# EAGLE design POWER SUPPLY_CURVE TRACER.V14 (EAGLE 7.3.0)
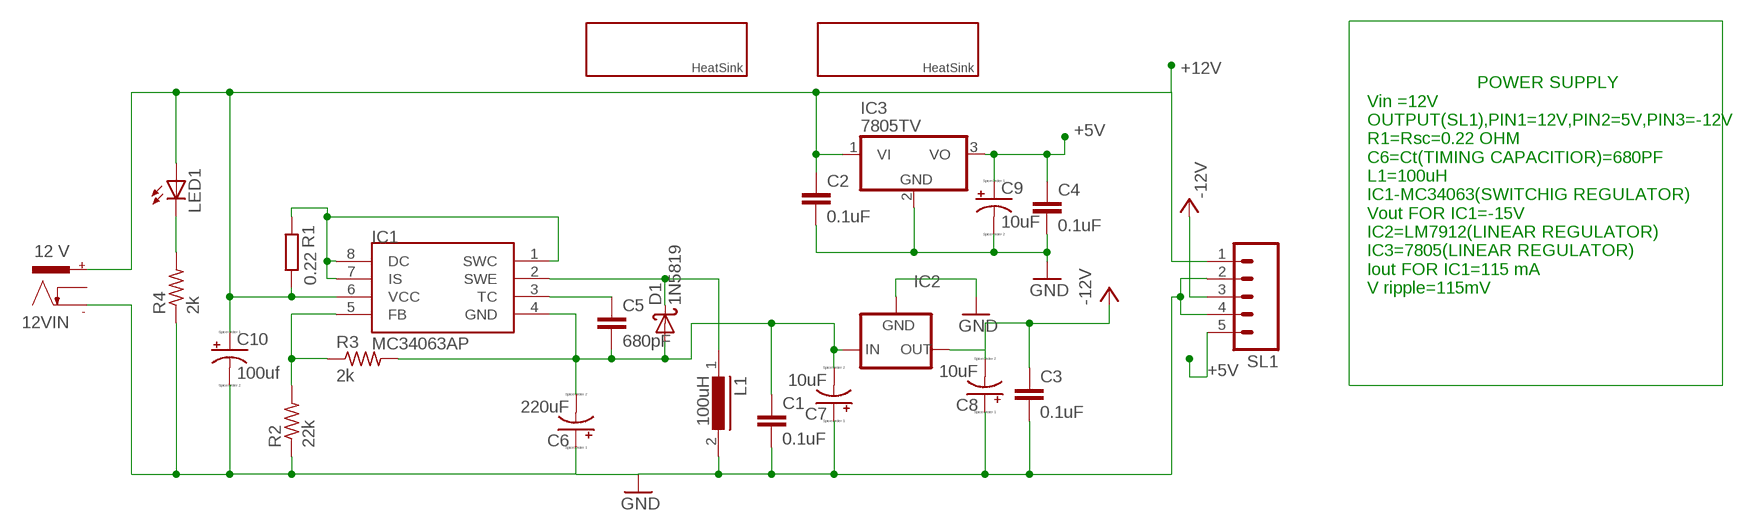
[diagram p0: schematic, sheet 1]

## Parts
12VIN  12 V  POWER_CON  [NEB21R]
C1  0.1uF  C-EU025-025X050  [C025-025X050]
C2  0.1uF  C-EU025-025X050  [C025-025X050]
C3  0.1uF  C-EU025-025X050  [C025-025X050]
C4  0.1uF  C-EU025-025X050  [C025-025X050]
C5  680pF  C-EU025-025X050  [C025-025X050]
C6  220uF  CPOL-USE2.5-7  [E2,5-7]
C7  10uF  CPOL-USE2.5-6  [E2,5-6]
C8  10uF  CPOL-USE2.5-6  [E2,5-6]
C9  10uF  CPOL-USE2.5-6  [E2,5-6]
C10  100uf  CPOL-USE2.5-7  [E2,5-7]
D1  1N5819  [DO41-10]
IC1  MC34063AP  [DIL08]
IC2  79XXS  [79XXS]
IC3  7805TV  [TO220V]
L1  100uH  82114R  [82114R]
LED1  LED3MM  [LED3MM]
R1  0.22  R-EU_0617/17  [0617/17]
R2  22k  RESISTOR0207/7  [0207/7]
R3  2k  R-US_0204/7  [0204/7]
R4  2k  RESISTOR0207/7  [0207/7]
SL1  M05  [05P]
U$1  HEATSINKMEDIUM  [HEATSINK-MED]
U$2  HEATSINKSMALL  [HEATSINK-SML]

## Nets
+5V: C4.1 C9.+ IC3.3(VO) SL1.5
+12V: 12VIN.+ C2.1 C10.+ IC1.6(VCC) IC3.1(VI) LED1.A R1.2 SL1.1
GND: 12VIN.- C1.2 C2.2 C3.2 C4.2 C6.+ C7.+ C8.+ C9.- C10.- IC2.GND IC3.2(GND) L1.2 R2.1 R4.1 SL1.2 SL1.4
N$3: IC1.5(FB) R2.2 R3.1
N$4: C1.1 C5.2 C6.- C7.- D1.A IC1.4(GND) IC2.IN R3.2
N$5: C5.1 IC1.3(TC)
N$6: D1.C IC1.2(SWE) L1.1
N$7: LED1.K(C) R4.2
N$9: IC1.1(SWC) IC1.7(IS) IC1.8(DC) R1.1
VCC: C3.1 C8.- IC2.OUT SL1.3 ; supply symbol labelled -12V
Unconnected: 12VIN.C

## Notes on the sheet
- POWER SUPPLY
  Vin =12V
  OUTPUT(SL1),PIN1=12V,PIN2=5V,PIN3=-12V
  R1=Rsc=0.22 OHM
  C6=Ct(TIMING CAPACITIOR)=680PF
  L1=100uH
  IC1-MC34063(SWITCHIG REGULATOR)
  Vout FOR IC1=-15V 
  IC2=LM7912(LINEAR REGULATOR)
  IC3=7805(LINEAR REGULATOR)
  Iout FOR IC1=115 mA
  V ripple=115mV

## Library data of the parts
12VIN = CEDT_JANUARY_2015_v5:POWER_CON: DC Power Connector
C1-C5 = rcl:C-EU: CAPACITOR, European symbol
C6-C10 = resistor:CPOL-US: POLARIZED CAPACITOR, American symbol
D1 = CEDT_JANUARY_2015_v5:1N5819: DIODE general purpose rectifier, 1 A
IC1 = mc34063:MC34063
IC2 = v-reg:79XXS: VOLTAGE REGULATOR
IC3 = linear:78*: Positive VOLTAGE REGULATOR Source: http://cache.national.com/ds/LM/LM78L05.pdf http://www.fairchildsemi.com/ds/LM/LM7805.pdf
L1 = inductors:82114R: INDUCTOR
LED1 = 01_adafruit:LED: LED OSRAM: - CHIPLED LG R971, LG N971, LY N971, LG Q971, LY Q971, LO R971, LY R971 LH N974, LH R974 LS Q976, LO Q976, LY Q976 LO Q996 - Hyper CHIPLED LW Q18S LB Q993, LB Q99A, LB R99A - SideLED LS A670, LO A670, LY A670, LG A670, LP A670 LB A673, LV A673, LT A673, LW A673 LH A674 LY A675 LS A676, LA A676, LO A676, LY A676, LW A676 LS A679, LY A679, LG A679 - Hyper Micro SIDELED® LS Y876, LA Y876, LO Y876, LY Y876 LT Y87S - SmartLED LW L88C, LW L88S LB L89C, LB L89S, LG L890 LS L89K, LO L89K, LY L89K LS L896, LA L896, LO L896, LY L896 - TOPLED LS T670, LO T670, LY T670, LG T670, LP T670 LSG T670, LSP T670, LSY T670, LOP T670, LYG T670 LG T671, LOG T671, LSG T671 LB T673, LV T673, LT T673, LW T673 LH T674 LS T676, LA T676, LO T676, LY T676, LB T676, LH T676, LSB T676, LW T676 LB T67C, LV T67C, LT T67C, LS T67K, LO T67K, LY T67K, LW E67C LS E67B, LA E67B, LO E67B, LY E67B, LB E67C, LV E67C, LT E67C LW T67C LS T679, LY T679, LG T679 LS T770, LO T770, LY T770, LG T770, LP T770 LB T773, LV T773, LT T773, LW T773 LH T774 LS E675, LA E675, LY E675, LS T675 LS T776, LA T776, LO T776, LY T776, LB T776 LHGB T686 LT T68C, LB T68C - Hyper Mini TOPLED® LB M676 - Mini TOPLED Santana® LG M470 LS M47K, LO M47K, LY M47K Source: http://www.osram.convergy.de/
R1 = rcl:R-EU_: RESISTOR, European symbol
R2 R4 = CEDT_JANUARY_2015_v5:RESISTOR
R3 = resistor:R-US_: RESISTOR, American symbol
SL1 = con-amp-quick:M05: AMP QUICK CONNECTOR; OC_FARNELL: unknown; OC_NEWARK: unknown
U$1 U$2 = CEDT_JANUARY_2015_v5:HEATSINK

## Board
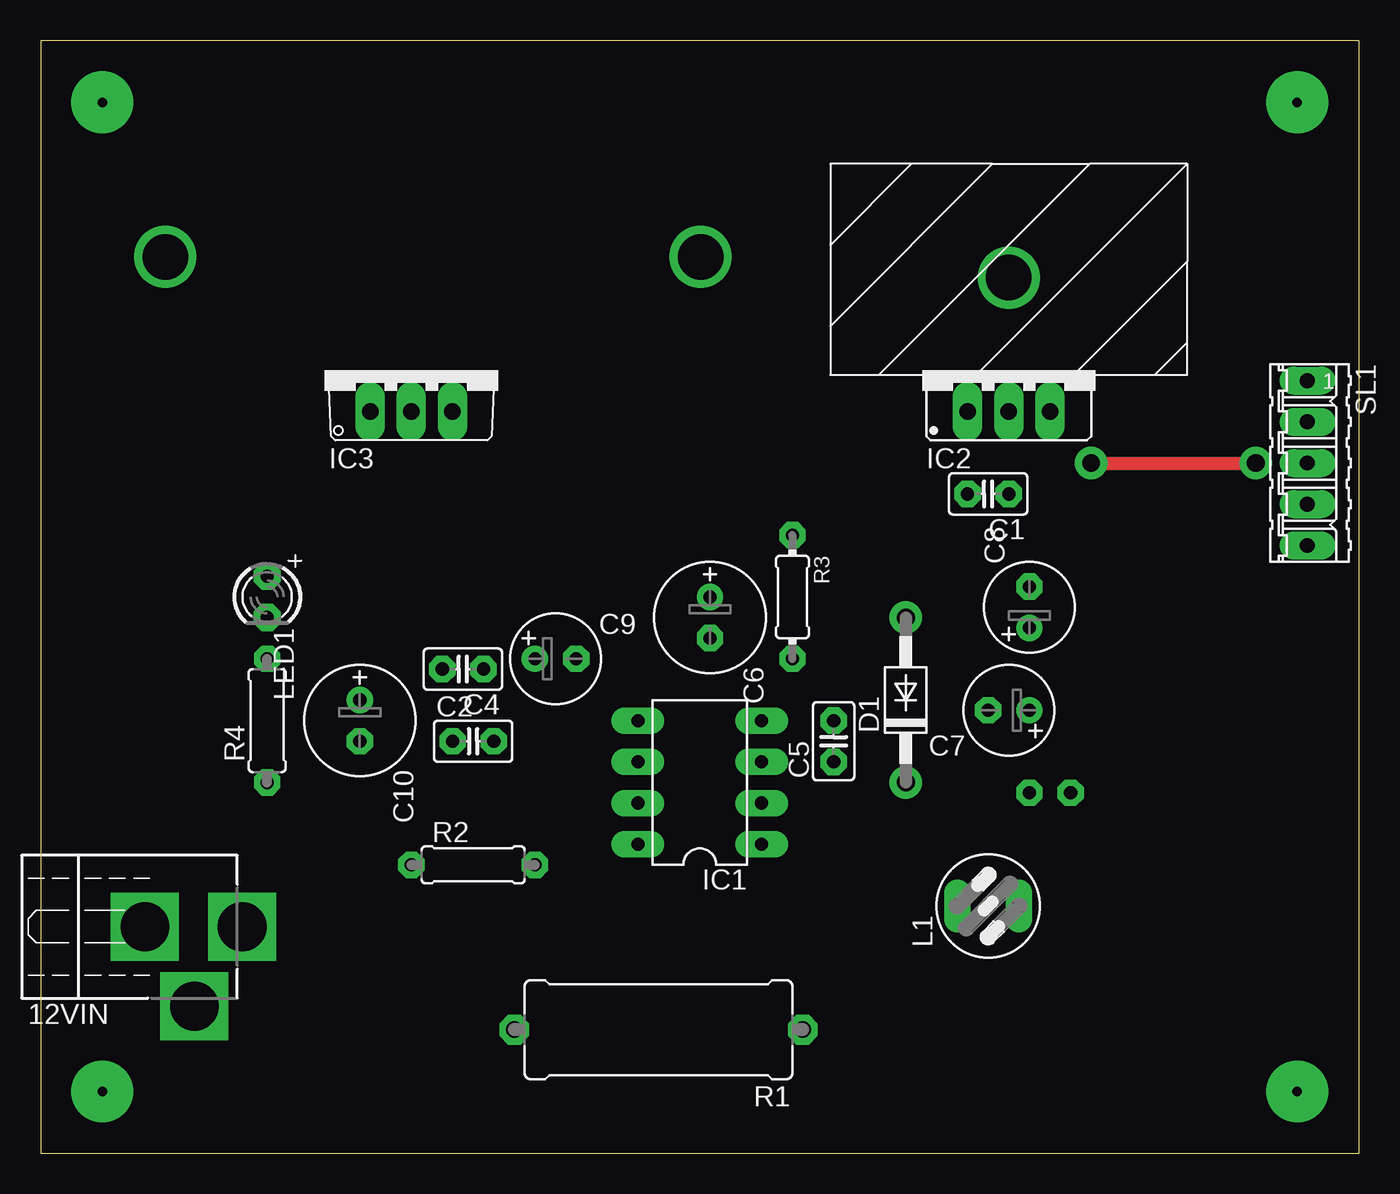
[diagram p1: board, top side]
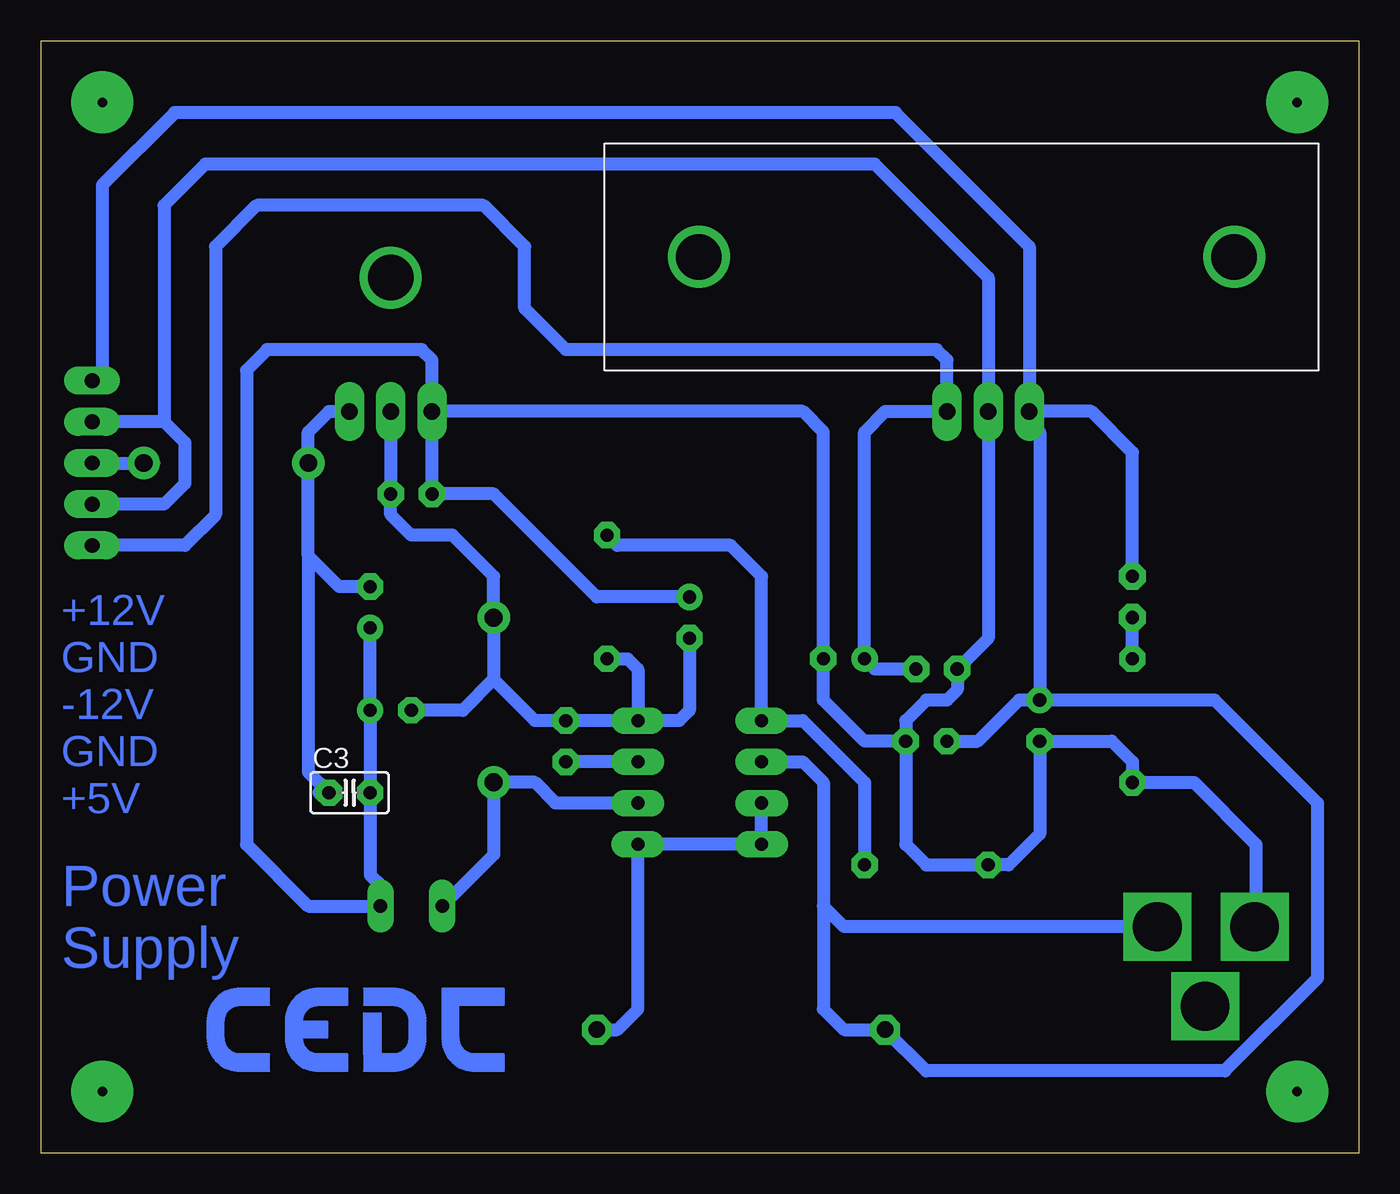
[diagram p2: board, bottom side, seen from below]

Size 81.28 x 68.58 mm. Coordinates in mm from the lower left corner, seen from the top.
Outline: 0,68.57 0,0 81.28,0 81.28,68.58 0,68.58
Copper layers (1*16): Top 0.035mm / dielectric 1.5mm / Bottom 0.035mm
Design rules "default *": minimum track width 10mil, minimum drill 24mil, track to track 12mil, track to pad 12mil, pad to pad 12mil, via to via 12mil, smd to smd 12mil, copper to edge 40mil, drill to drill 8mil, minimum pad ring 16mil, minimum via ring 16mil, stop-mask expansion 4mil, vias tented up to drill 0mil, thermal gap 10mil

### Footprints (pad centres in the part's own frame; a part is rotated, then mirrored left to right if it is on the bottom)
NEB21R = drill 3 pad 4.2 square: + 0,3.54; - 0,-2.46; C 4.9,0.59
C025-025X050 = drill 0.813 octagon: 1 -1.27,0; 2 1.27,0
E2,5-7 = drill 0.813 pad 1.6: + -1.27,0 | drill 0.813 pad 1.6 octagon: - 1.27,0
E2,5-6 = drill 0.813 pad 1.6: + -1.27,0 | drill 0.813 pad 1.6 octagon: - 1.27,0
DO41-10 = drill 1.118: A 5.08,0; C -5.08,0
DIL08 = drill 0.813 long: 1 -3.81,-3.81; 2 -1.27,-3.81; 3 1.27,-3.81; 4 3.81,-3.81; 5 3.81,3.81; 6 1.27,3.81; 7 -1.27,3.81; 8 -3.81,3.81
79XXS = drill 1.016 long: GND -2.54,-2.54; IN 0,-2.54; OUT 2.54,-2.54
TO220V = drill 1.016 long: 1 -2.54,-2.54; 2 0,-2.54; 3 2.54,-2.54
82114R = drill 0.813 long: 1 0,1.905; 2 0,-1.905
LED3MM = drill 0.813 pad 1.676 octagon: A -1.27,0; K 1.27,0
0617/17 = drill 1.016 octagon: 1 -8.89,0; 2 8.89,0
0207/7 = drill 0.813 octagon: 1 -3.81,0; 2 3.81,0
0204/7 = drill 0.813 octagon: 1 -3.81,0; 2 3.81,0
05P = drill 0.914 long: 1 -5.08,0; 2 -2.54,0; 3 0,0; 4 2.54,0; 5 5.08,0
HEATSINK-MED = drill 2.8 pad 3.81: P$1 -15.8,0; P$2 17.2,0

### Placement (x,y rotation side)
12VIN  8.89,13.97 270 top
C1  58.42,40.64 180 top
C2  26.67,25.4 0 top
C3  62.23,22.23 0 bottom
C4  26.04,29.84 180 top
C5  48.9,25.4 90 top
C6  41.27,33.02 270 top
C7  59.69,27.3 180 top
C8  60.96,33.66 90 top
C9  31.75,30.48 0 top
C10  19.68,26.67 270 top
D1  53.34,27.94 90 top
IC1  40.64,22.86 90 top
IC2  59.69,48.26 0 top
IC3  22.86,48.26 0 top
L1  58.42,15.24 90 top
LED1  13.97,34.29 270 top
R1  38.1,7.62 180 top
R2  26.67,17.78 0 top
R3  46.35,34.29 270 top
R4  13.97,26.67 90 top
SL1  78.11,42.55 270 top
U$1  23.5,55.24 0 top
U$2  59.69,53.98 0 top
U$3  [LOGO-CEDT-BOT-18MM]  52.7,5.08 0 top

### Tracks (layer width: path | path; a pad name or v marks a point on that pad's centre or on a via)
+5V
  Bottom 0.813: C4.1 29.84,29.84 C9.+ 30.48,44.45 29.21,45.72 IC3.3 25.4,48.9 26.04,49.53 48.9,49.53 51.44,52.07 51.44,55.88 53.98,58.42 67.94,58.42 70.48,55.88 70.48,39.37 72.39,37.47 SL1.5
+12V
  Bottom 0.813: C2.1 23.5,25.4 20.95,27.94 C10.+ 19.05,27.94 | 19.05,27.94 8.89,27.94 2.54,21.59 2.54,10.79 8.26,5.08 26.67,5.08 R1.2 31.75,7.62 33.02,8.89 33.02,15.24 | LED1.A 13.97,43.18 16.51,45.72 IC3.1 | 12VIN.+ 31.75,13.97 33.02,15.24 | IC3.1 20.32,55.88 28.57,64.14 73.03,64.14 77.47,59.69 77.47,48.26 SL1.1 | IC3.1 20.32,45.09 19.68,44.45 19.68,28.57 19.05,27.94 | IC1.6 34.29,24.13 33.02,22.86 33.02,15.24
GND
  Bottom 0.813: C2.2 27.94,19.05 26.67,17.78 R2.1 21.59,17.78 19.68,19.68 C10.- 15.24,25.4 13.97,24.13 R4.1 10.16,22.86 6.35,19.05 6.35,14.05 12VIN.- | C2.2 30.48,25.4 33.02,27.94 C9.- 33.02,44.45 34.29,45.72 IC2.GND | C2.2 27.94,26.67 26.67,27.94 25.4,27.94 24.77,28.57 C4.2 22.86,31.75 IC3.2 22.86,53.98 29.84,60.96 71.12,60.96 73.66,58.42 73.66,45.09 | C8.+ C7.+ C3.2 60.96,17.14 60.33,16.51 L1.2 64.77,15.24 68.58,19.05 68.58,48.26 67.31,49.53 57.78,49.53 57.15,48.9 IC2.GND | IC2.GND C1.2 53.34,40.64 46.99,34.29 C6.+ | SL1.4 73.66,40.01 72.39,41.27 72.39,43.81 73.66,45.09 | 73.66,45.09 SL1.2
N$3
  Bottom 0.813: R2.2 30.48,22.86 34.29,26.67 IC1.5 36.83,35.56 38.73,37.47 45.72,37.47 R3.1
N$4
  Bottom 0.813: C6.- 41.27,27.3 41.91,26.67 IC1.4 | IC1.4 C5.2 50.8,26.67 53.34,29.21 | 53.34,29.21 D1.A 53.34,35.56 55.88,38.1 58.42,38.1 59.69,39.37 C1.1 IC2.IN | 53.34,29.21 55.24,27.3 C7.- | R3.2 45.09,30.48 44.45,29.84 IC1.4
N$5
  Bottom 0.813: IC1.3 C5.1
N$6
  Bottom 0.813: IC1.2 49.53,21.59 50.8,22.86 D1.C 53.34,18.41 L1.1
N$7
  Bottom 0.813: R4.2 LED1.K
N$9
  Bottom 0.813: IC1.7 IC1.8 IC1.1 44.45,8.89 45.72,7.62 R1.1
N$11  (via drill 2.8 pad 3.81)
  other vias: 59.69,53.98
N$15  (via drill 0.6 pad 3.81)
  other vias: 3.81,64.77
N$16  (via drill 0.6 pad 3.81)
  other vias: 77.47,64.77
N$17  (via drill 0.6 pad 3.81)
  other vias: 77.47,3.81
N$18  (via drill 0.6 pad 3.81)
  other vias: 3.81,3.81
VCC  (via drill 1.1 pad 1.93)
  Top 0.813: v64.77,42.55 v74.93,42.55
  Bottom 0.813: 64.77,36.83 v64.77,42.55 64.77,44.45 63.5,45.72 IC2.OUT | C8.- 62.87,34.92 64.77,36.83 | SL1.3 v74.93,42.55 74.3,42.55 | 64.14,22.23 C3.1 64.77,23.5 64.77,36.83

### Text on the board
Bottom: +12V / GND / -12V / GND / +5V | Power / Supply